# Altium schematic sheet Hardware.SchDoc: Hardware
size A4; DocumentNumber: 4; Revision: 1; SheetNumber: 4; SheetTotal: 4
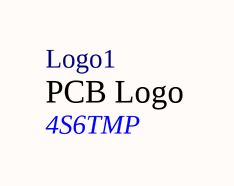
[diagram p0: Hardware.SchDoc]

## Parts
Logo1  4S6TMP Logo  [4S6TMP Logo]  (value not drawn)  (no BOM)

## Notes on the sheet
- Title
- Size:
- Date:
- A4
- Number:
- Time:
- Revision:
- Sheet
- of
- File:
- (in symbol 4S6TMP-logo) PCB Logo; 4S6TMP

## Library data of the parts
Logo1 = 4S6TMP-logo: Codeverto Logo